# Altium schematic sheet fpga.SchDoc
size 431 x 279 mm
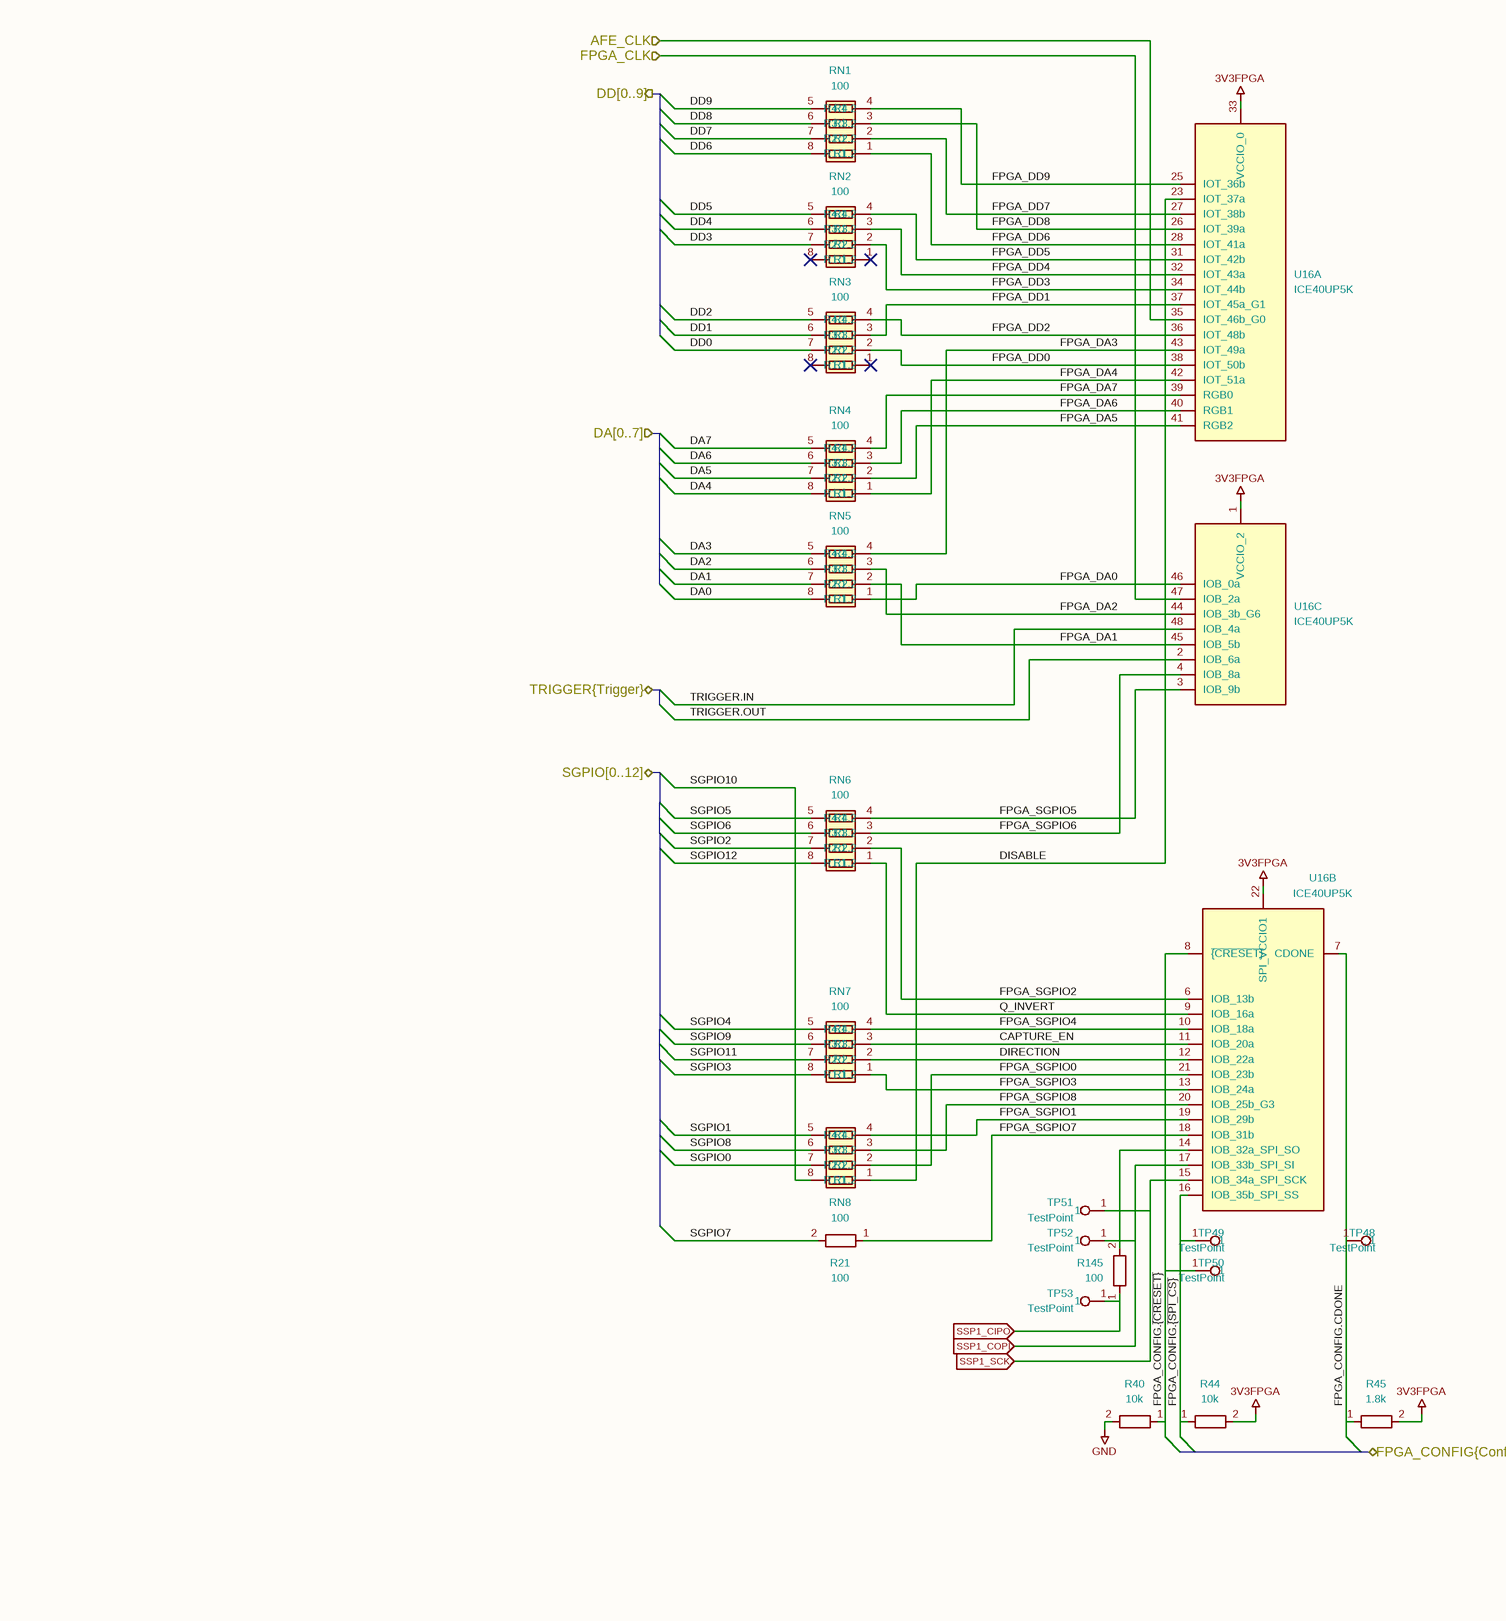
[diagram p0: fpga.SchDoc, left]
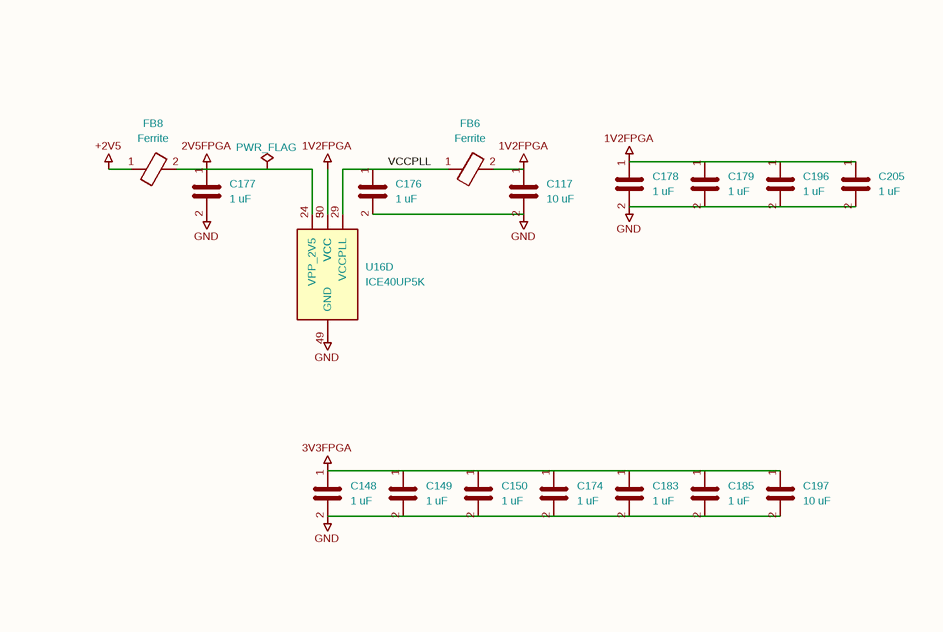
[diagram p1: fpga.SchDoc, right]

## Parts
#FLG011  PWR_FLAG  (graphical)
C117  10 uF  [C_0805_2012Metric]
C148  1 uF  [C_0201_0603Metric]
C149  1 uF  [C_0201_0603Metric]
C150  1 uF  [C_0201_0603Metric]
C174  1 uF  [C_0201_0603Metric]
C176  1 uF  [C_0201_0603Metric]
C177  1 uF  [C_0201_0603Metric]
C178  1 uF  [C_0201_0603Metric]
C179  1 uF  [C_0201_0603Metric]
C183  1 uF  [C_0201_0603Metric]
C185  1 uF  [C_0201_0603Metric]
C196  1 uF  [C_0201_0603Metric]
C197  10 uF  [C_0805_2012Metric]
C205  1 uF  [C_0201_0603Metric]
FB6  Ferrite  [L_0603_1608Metric]
FB8  Ferrite  [L_0603_1608Metric]
R21  100  [R_0201_0603Metric]
R40  10k  [R_0402_1005Metric]
R44  10k  [R_0402_1005Metric]
R45  1.8k  [R_0402_1005Metric]
R145  100  [R_0201_0603Metric]
RN1  100  [R_Array_Convex_4x0402]
RN2  100  [R_Array_Convex_4x0402]
RN3  100  [R_Array_Convex_4x0402]
RN4  100  [R_Array_Convex_4x0402]
RN5  100  [R_Array_Convex_4x0402]
RN6  100  [R_Array_Convex_4x0402]
RN7  100  [R_Array_Convex_4x0402]
RN8  100  [R_Array_Convex_4x0402]
TP48  TestPoint  [TestPoint_Pad_D1.0mm]
TP49  TestPoint  [TestPoint_Pad_D1.0mm]
TP50  TestPoint  [TestPoint_Pad_D1.0mm]
TP51  TestPoint  [TestPoint_Pad_D1.0mm]
TP52  TestPoint  [TestPoint_Pad_D1.0mm]
TP53  TestPoint  [TestPoint_Pad_D1.0mm]
U16  ICE40UP5K  [QFN-48-1EP_7x7mm_P0.5mm_EP5.6x5.6mm_ThermalVias]  (parts A,B,C,D of 4)

## Ports
AFE_CLK (in), DA[0..7] (in), DD[0..9] (out), FPGA_CLK (in), FPGA_CONFIG{Config} (bidir), SGPIO[0..12] (bidir), SSP1_CIPO (in), SSP1_COPI (in), SSP1_SCK (in), TRIGGER{Trigger} (bidir)

## Nets
1V2FPGA: C117.1 C178.1 C179.1 C196.1 C205.1 FB6.2 U16.5(VCC) U16.30(VCC)
2V5FPGA: #FLG011.1 C177.1 FB8.2 U16.24(VPP_2V5)
3V3FPGA: C148.1 C149.1 C150.1 C174.1 C183.1 C185.1 C197.1 R44.2 R45.2 U16.1(VCCIO_2) U16.22(SPI_VCCIO1) U16.33(VCCIO_0)
+2V5: FB8.1
GND: C117.2 C148.2 C149.2 C150.2 C174.2 C176.2 C177.2 C178.2 C179.2 C183.2 C185.2 C196.2 C197.2 C205.2 R40.2 U16.49(GND)
AFE_CLK: U16.35(IOT_46b_G0) ; port AFE_CLK
CAPTURE_EN: RN7.3(R3.1) U16.11(IOB_20a)
DA0: RN5.8(R1.2)
DA1: RN5.7(R2.2)
DA2: RN5.6(R3.2)
DA3: RN5.5(R4.2)
DA4: RN4.8(R1.2)
DA5: RN4.7(R2.2)
DA6: RN4.6(R3.2)
DA7: RN4.5(R4.2)
DD0: RN3.7(R2.2)
DD1: RN3.6(R3.2)
DD2: RN3.5(R4.2)
DD3: RN2.7(R2.2)
DD4: RN2.6(R3.2)
DD5: RN2.5(R4.2)
DD6: RN1.8(R1.2)
DD7: RN1.7(R2.2)
DD8: RN1.6(R3.2)
DD9: RN1.5(R4.2)
DIRECTION: RN7.2(R2.1) U16.12(IOB_22a)
DISABLE: RN8.1(R1.1) U16.23(IOT_37a)
FPGA_CLK: U16.47(IOB_2a) ; port FPGA_CLK
FPGA_CONFIG.CDONE: R45.1 TP48.1 U16.7(CDONE)
FPGA_CONFIG.~{{CRESET}}: R40.1 TP50.1 U16.8(~{{CRESET}})
FPGA_CONFIG.~{{SPI_CS}}: R44.1 TP49.1 U16.16(IOB_35b_SPI_SS)
FPGA_DA0: RN5.1(R1.1) U16.46(IOB_0a)
FPGA_DA1: RN5.2(R2.1) U16.45(IOB_5b)
FPGA_DA2: RN5.3(R3.1) U16.44(IOB_3b_G6)
FPGA_DA3: RN5.4(R4.1) U16.43(IOT_49a)
FPGA_DA4: RN4.1(R1.1) U16.42(IOT_51a)
FPGA_DA5: RN4.2(R2.1) U16.41(RGB2)
FPGA_DA6: RN4.3(R3.1) U16.40(RGB1)
FPGA_DA7: RN4.4(R4.1) U16.39(RGB0)
FPGA_DD0: RN3.2(R2.1) U16.38(IOT_50b)
FPGA_DD1: RN3.3(R3.1) U16.37(IOT_45a_G1)
FPGA_DD2: RN3.4(R4.1) U16.36(IOT_48b)
FPGA_DD3: RN2.2(R2.1) U16.34(IOT_44b)
FPGA_DD4: RN2.3(R3.1) U16.32(IOT_43a)
FPGA_DD5: RN2.4(R4.1) U16.31(IOT_42b)
FPGA_DD6: RN1.1(R1.1) U16.28(IOT_41a)
FPGA_DD7: RN1.2(R2.1) U16.27(IOT_38b)
FPGA_DD8: RN1.3(R3.1) U16.26(IOT_39a)
FPGA_DD9: RN1.4(R4.1) U16.25(IOT_36b)
FPGA_SGPIO0: RN8.2(R2.1) U16.21(IOB_23b)
FPGA_SGPIO1: RN8.4(R4.1) U16.19(IOB_29b)
FPGA_SGPIO2: RN6.2(R2.1) U16.6(IOB_13b)
FPGA_SGPIO3: RN7.1(R1.1) U16.13(IOB_24a)
FPGA_SGPIO4: RN7.4(R4.1) U16.10(IOB_18a)
FPGA_SGPIO5: RN6.4(R4.1) U16.3(IOB_9b)
FPGA_SGPIO6: RN6.3(R3.1) U16.4(IOB_8a)
FPGA_SGPIO7: R21.1 U16.18(IOB_31b)
FPGA_SGPIO8: RN8.3(R3.1) U16.20(IOB_25b_G3)
Q_INVERT: RN6.1(R1.1) U16.9(IOB_16a)
SGPIO0: RN8.7(R2.2)
SGPIO1: RN8.5(R4.2)
SGPIO2: RN6.7(R2.2)
SGPIO3: RN7.8(R1.2)
SGPIO4: RN7.5(R4.2)
SGPIO5: RN6.5(R4.2)
SGPIO6: RN6.6(R3.2)
SGPIO7: R21.2
SGPIO8: RN8.6(R3.2)
SGPIO9: RN7.6(R3.2)
SGPIO10: RN8.8(R1.2)
SGPIO11: RN7.7(R2.2)
SGPIO12: RN6.8(R1.2)
SSP1_CIPO: R145.1 TP53.1 ; port SSP1_CIPO
SSP1_COPI: TP52.1 U16.17(IOB_33b_SPI_SI) ; port SSP1_COPI
SSP1_SCK: TP51.1 U16.15(IOB_34a_SPI_SCK) ; port SSP1_SCK
TRIGGER.IN: U16.48(IOB_4a)
TRIGGER.OUT: U16.2(IOB_6a)
VCCPLL: C176.1 FB6.1 U16.29(VCCPLL)
NetR145_2: R145.2 U16.14(IOB_32a_SPI_SO)

Not connected (* = marked no-connect by the designer): RN2 1(R1.1)* 8(R1.2)*; RN3 1(R1.1)* 8(R1.2)*

## Notes on the sheet
- 1
- 2
- 3
- 4
- 5
- 6
- 7
- 8
- A
- B
- C
- D
- E
- ${LICENSE}
- Title: ${TITLE}
- File: fpga.kicad_sch
- Sheet: /
- ${COPYRIGHT}
- KiCad E.D.A.  kicad (5.1.4)-1
- Size: USLedger
- Date: ${DATE}
- Rev: ${VERSION}
- Id: 1/1

## Library data of the parts
#FLG011 = PWR_FLAG: Description: Special symbol for telling ERC where power comes from; Value: PWR_FLAG
C117 = C: Part Number: CL21A106KOQNNNE; Manufacturer: Samsung; Description: CAP CER 10UF 16V X5R 0805; Substitution: Murata GRM155R61E105KA12D; Value: 10 uF; Footprint: Capacitor_SMD:C_0805_2012Metric
C148-C150 C174 C176-C179 C183 C185 C196 C205 = C: Part Number: GRM033R61A105ME44D; Manufacturer: Murata; Description: CAP CER 1UF 10V X5R 0201; Substitution: GRM033R61A105ME44*, GRM033R61C105ME15*, Samsung CL03A105MO3NRN*; Value: 1 uF; Footprint: Capacitor_SMD:C_0201_0603Metric
C197 = C: Manufacturer: Samsung; Part Number: CL21A106KOQNNNE; Description: CAP CER 10UF 16V X5R 0805; Substitution: Murata GRM21BR61A106KE19L; Value: 10 uF; Footprint: Capacitor_SMD:C_0805_2012Metric
FB6 FB8 = FerriteBead: Manufacturer: TAI-TECH; Part Number: HCB1608KF-102T10; Description: 1kΩ@100MHz 200mΩ ±25% 0603 Ferrite Bead; Substitution: Murata BLM18KG102SN1*; Value: Ferrite; Footprint: Inductor_SMD:L_0603_1608Metric
R21 R145 = R: Manufacturer: Yageo; Part Number: RC0201JR-07100RL; Description: RES 100 OHM 5% 1/20W 0201; Substitution: any equivalent; Value: 100; Footprint: Resistor_SMD:R_0201_0603Metric
R40 R44 = R: Manufacturer: Yageo; Part Number: RC0402JR-0710KL; Description: RES 10K OHM 1/16W 5% 0402 SMD; Substitution: any equivalent; Value: 10k; Footprint: Resistor_SMD:R_0402_1005Metric
R45 = R: Manufacturer: Yageo; Part Number: RC0402JR-071K8L; Description: RES 1.8K OHM 5% 1/16W 0402; Substitution: any equivalent; Value: 1.8k; Footprint: Resistor_SMD:R_0402_1005Metric
RN1-RN8 = R_Pack04: Manufacturer: Yageo; Part Number: YC124-JR-07100RL; Description: RES ARRAY 4 RES 100 OHM 0804; Substitution: any equivalent; Value: 100; Footprint: Resistor_SMD:R_Array_Convex_4x0402
U16 = ICE40UP5K-SG48ITR: Manufacturer: Lattice; Description: iCE40 UltraPlus FPGA, 5280 LUTs, 1.2V, 48-pin QFN; Part Number: ICE40UP5K-SG48ITR; Value: ICE40UP5K; Footprint: praline:QFN-48-1EP_7x7mm_P0.5mm_EP5.6x5.6mm_ThermalVias
TP48-TP53 = TestPoint: Value: TestPoint; Footprint: TestPoint:TestPoint_Pad_D1.0mm